# EAGLE design console (EAGLE 9.6.2)
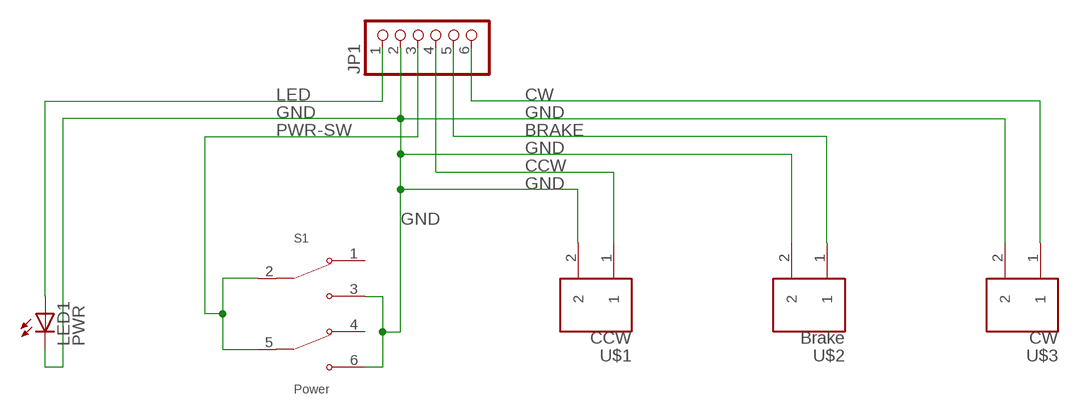
[diagram p0: schematic, sheet 1]

## Parts
JP1  PINHD-1X6  [1X06]
LED1  PWR  LEDCHIPLED_0805  [CHIPLED_0805]
S1  Power  IM211  [IM211]
U$1  CCW  CYT1115-SPST  [SPST-5MM]
U$2  Brake  CYT1115-SPST  [SPST-5MM]
U$3  CW  CYT1115-SPST  [SPST-5MM]

## Nets
BRAKE: JP1.5 U$2.1
CCW: JP1.4 U$1.1
CW: JP1.6 U$3.1
GND: JP1.2 LED1.C S1.3(NO1) S1.6(NO2) U$1.2 U$2.2 U$3.2
LED: JP1.1 LED1.A
PWR-SW: JP1.3 S1.2(COM1) S1.5(COM2)
Unconnected: S1.1(NC1) S1.4(NC2)

## Library data of the parts
JP1 = pinhead:PINHD-1X6: PIN HEADER
LED1 = ladyada:LED: LED OSRAM: - CHIPLED LG R971, LG N971, LY N971, LG Q971, LY Q971, LO R971, LY R971 LH N974, LH R974 LS Q976, LO Q976, LY Q976 LO Q996 - Hyper CHIPLED LW Q18S LB Q993, LB Q99A, LB R99A - SideLED LS A670, LO A670, LY A670, LG A670, LP A670 LB A673, LV A673, LT A673, LW A673 LH A674 LY A675 LS A676, LA A676, LO A676, LY A676, LW A676 LS A679, LY A679, LG A679 - Hyper Micro SIDELED® LS Y876, LA Y876, LO Y876, LY Y876 LT Y87S - SmartLED LW L88C, LW L88S LB L89C, LB L89S, LG L890 LS L89K, LO L89K, LY L89K LS L896, LA L896, LO L896, LY L896 - TOPLED LS T670, LO T670, LY T670, LG T670, LP T670 LSG T670, LSP T670, LSY T670, LOP T670, LYG T670 LG T671, LOG T671, LSG T671 LB T673, LV T673, LT T673, LW T673 LH T674 LS T676, LA T676, LO T676, LY T676, LB T676, LH T676, LSB T676, LW T676 LB T67C, LV T67C, LT T67C, LS T67K, LO T67K, LY T67K, LW E67C LS E67B, LA E67B, LO E67B, LY E67B, LB E67C, LV E67C, LT E67C LW T67C LS T679, LY T679, LG T679 LS T770, LO T770, LY T770, LG T770, LP T770 LB T773, LV T773, LT T773, LW T773 LH T774 LS E675, LA E675, LY E675, LS T675 LS T776, LA T776, LO T776, LY T776, LB T776 LHGB T686 LT T68C, LB T68C - Hyper Mini TOPLED® LB M676 - Mini TOPLED Santana® LG M470 LS M47K, LO M47K, LY M47K Source: http://www.osram.convergy.de/
S1 = IM211-spdt-switch:IM211: Check availability <https://pricing.snapeda.com/parts/TL2230EEF100/E-Switch/view-part?ref=eda>; AVAILABILITY: In Stock; DESCRIPTION: Pushbutton Switch DPDT Standard Through Hole; MF: E-Switch; MP: TL2230EEF100; PACKAGE: None; PRICE: None; PURCHASE-URL: https://pricing.snapeda.com/search/part/TL2230EEF100/?ref=eda
U$1-U$3 = cyt1115:CYT1115-SPST

## Board
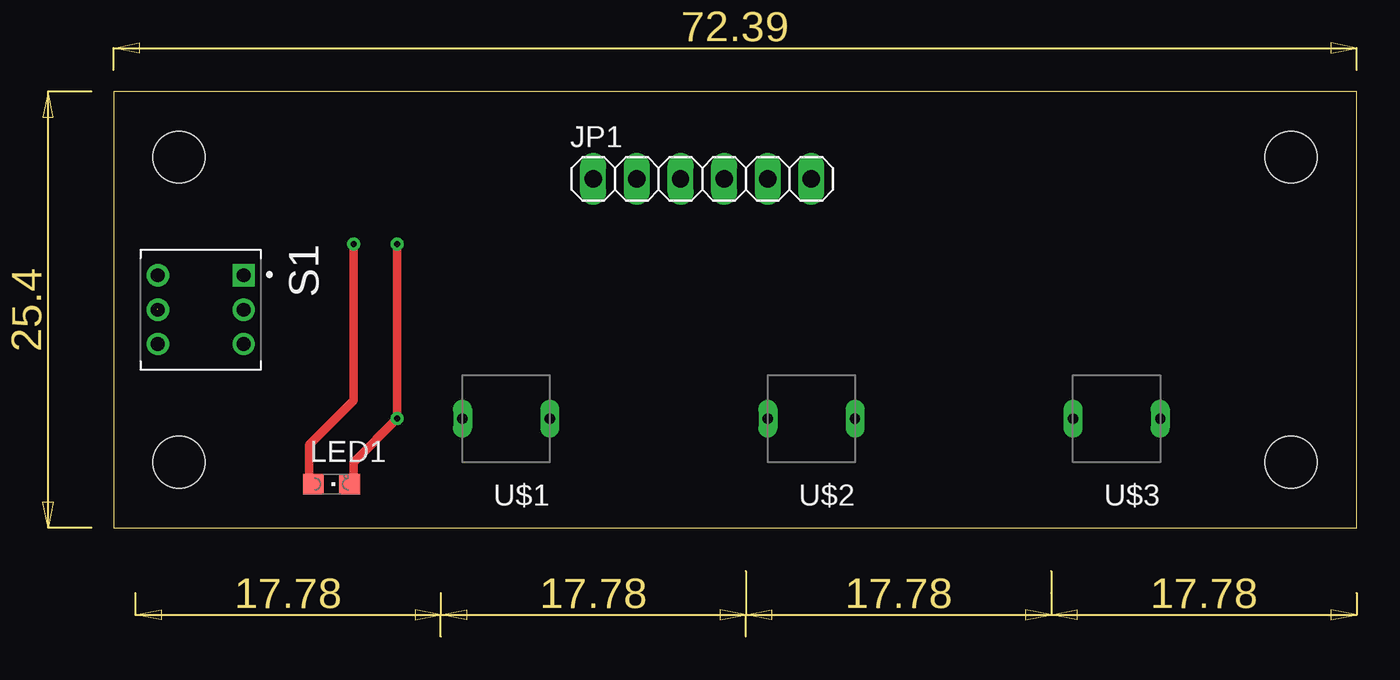
[diagram p1: board, top side]
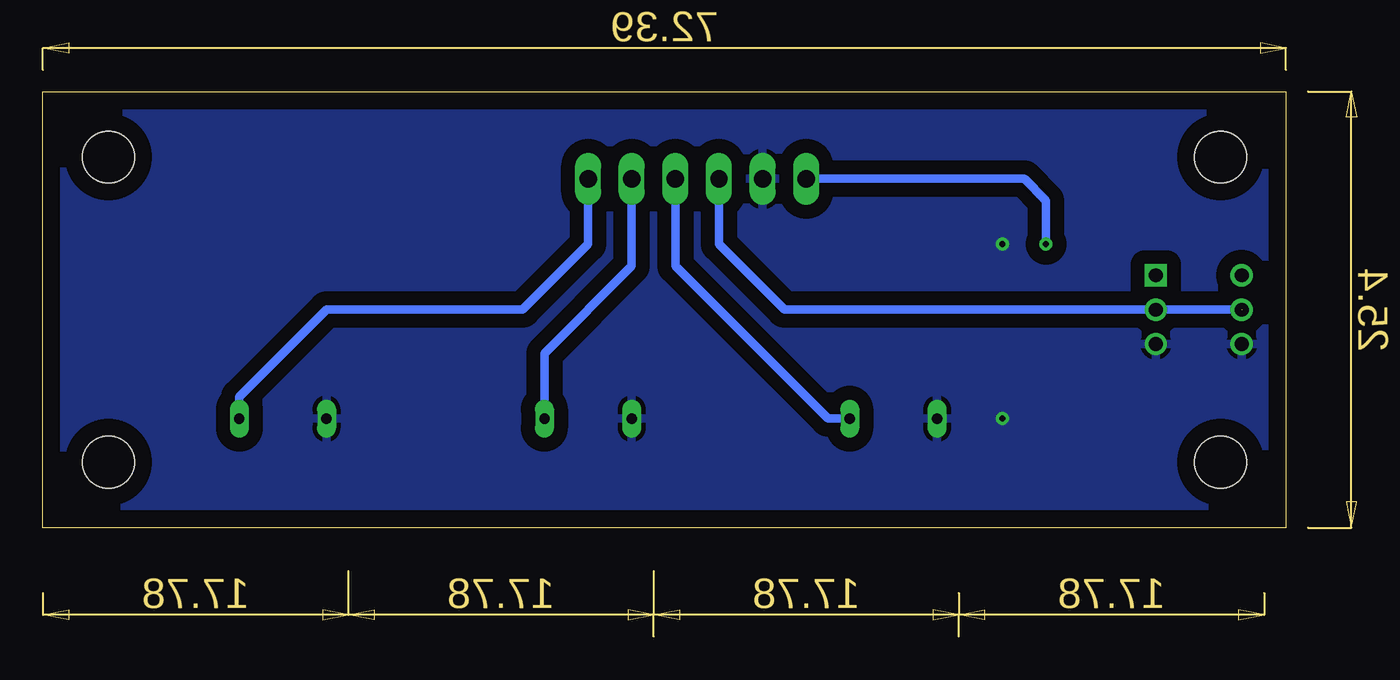
[diagram p2: board, bottom side, seen from below]

Size 72.39 x 25.4 mm. Coordinates in mm from the lower left corner, seen from the top.
Outline: 0,0 72.39,0 72.39,25.4 0,25.4 0,0
Copper layers (1*16): Top 0.035mm / dielectric 1.5mm / Bottom 0.035mm
Design rules "default": minimum track width 6mil, minimum drill 0.35mm, track to track 6mil, track to pad 6mil, pad to pad 6mil, via to via 6mil, smd to smd 6mil, copper to edge 40mil, drill to drill 6mil, minimum pad ring 10mil, minimum via ring 8mil, stop-mask expansion 4mil, vias tented up to drill 0mil, thermal gap 10mil
Holes 3 mm at 3.81,21.59 3.81,3.81 68.58,3.81 68.58,21.59

### Footprints (pad centres in the part's own frame; a part is rotated, then mirrored left to right if it is on the bottom)
1X06 = drill 1.016 long: 1 -6.35,0; 2 -3.81,0; 3 -1.27,0; 4 1.27,0; 5 3.81,0; 6 6.35,0
CHIPLED_0805 = smd 1.2 x 1.2: A 0,-1.05; C 0,1.05
IM211 = drill 0.8 square: 1 -2,2.5 | drill 0.8: 2 0,2.5; 3 2,2.5; 4 -2,-2.5; 5 0,-2.5; 6 2,-2.5
SPST-5MM = drill 0.6 long: 1 0,0; 2 5.08,0

### Placement (x,y rotation side)
JP1  34.29,20.32 0 top
LED1  12.7,2.54 270 top
S1  5.08,12.7 270 top
U$1  25.4,6.35 180 top
U$2  43.18,6.35 180 top
U$3  60.96,6.35 180 top

### Tracks (layer width: path | path; a pad name or v marks a point on that pad's centre or on a via)
BRAKE
  Bottom 0.508: U$2.1 43.18,10.16 38.1,15.24 JP1.5
CCW
  Bottom 0.508: U$1.1 26.67,6.35 35.56,15.24 JP1.4
CW
  Bottom 0.508: U$3.1 60.96,7.62 55.88,12.7 44.45,12.7 40.64,16.51 JP1.6
GND  (via drill 0.35)
  Top 0.508: v16.51,16.51 v16.51,6.35 13.97,3.81 13.97,2.54 LED1.C
  pour Bottom (isolate 0.813): 1.27,0 0,1.27 0,24.13 1.27,25.4 71.12,25.4 72.39,24.13 72.39,1.27 71.12,0
LED  (via drill 0.35)
  Top 0.508: LED1.A 11.4,2.79 11.4,4.83 13.97,7.4 v13.97,16.51
  Bottom 0.508: v13.97,16.51 13.97,19.05 15.24,20.32 JP1.1
PWR-SW  (1 unrouted)
  Bottom 0.508: 2.54,12.7 S1.2 29.21,12.7 33.02,16.51 JP1.3